# Altium schematic sheet interface.SchDoc: User interface
size A4; Author: Samuel López; DocumentNumber: 5; SheetNumber: 5; SheetTotal: 6
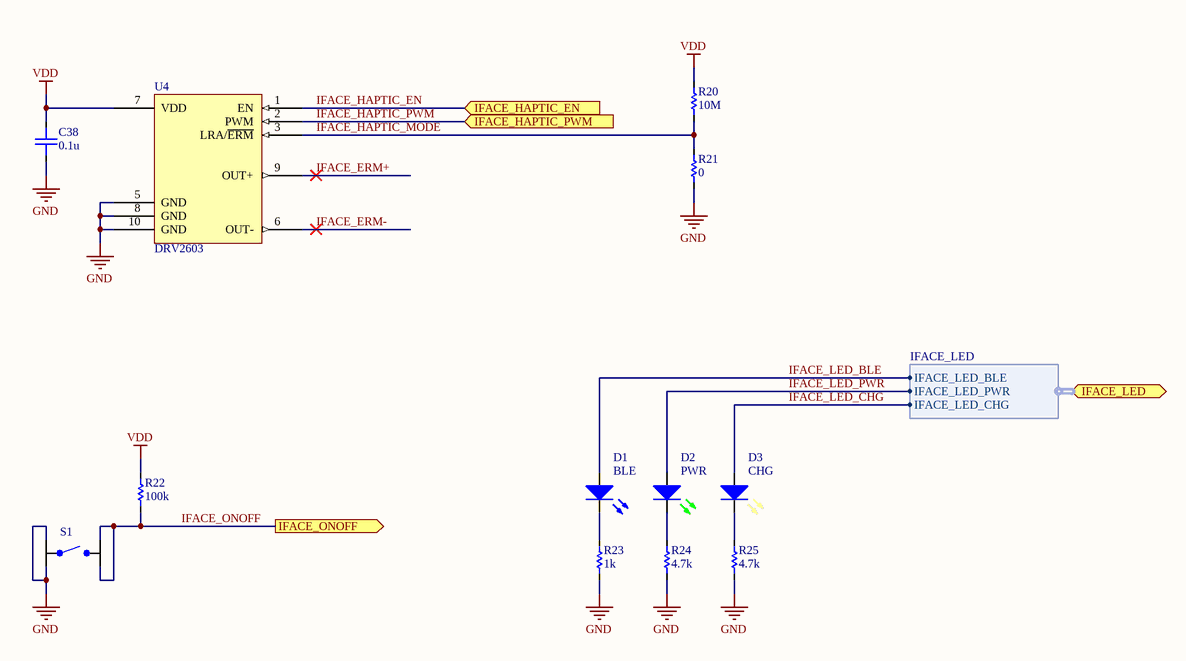
[diagram p0: interface.SchDoc]

## Parts
C38  0.1u  [C0402]
D1  BLE  [WL-SMCW 0603]
D2  PWR  [WL-SMCW 0603]
D3  CHG  [WL-SMCW 0603]
R20  10M  [R0402]
R21  0  [R0402]
R22  100k  [R0402]
R23  1k  [R0402]
R24  4.7k  [R0402]
R25  4.7k  [R0402]
S1  WE434351045816  [WE434351045816]  (value not drawn)
U4  DRV2603  [DRV2603]

## Ports
IFACE_HAPTIC_EN (in), IFACE_HAPTIC_PWM (in), IFACE_LED (harness IFACE_LED), IFACE_ONOFF (out)

## Harnesses
IFACE_LED: IFACE_LED_CHG, IFACE_LED_PWR, IFACE_LED_BLE

## Nets
GND: C38.1 R21.1 R23.1 R24.1 R25.1 S1.1 S1.3 U4.5(GND) U4.8(GND) U4.10(GND)
VDD: C38.2 R20.2 R22.2 U4.7(VDD)
IFACE_ERM+: U4.9(OUT+)
IFACE_ERM-: U4.6(OUT-)
IFACE_HAPTIC_EN: U4.1(EN) ; port IFACE_HAPTIC_EN
IFACE_HAPTIC_MODE: R20.1 R21.2 U4.3(LRA/~{ERM})
IFACE_HAPTIC_PWM: U4.2(PWM) ; port IFACE_HAPTIC_PWM
IFACE_LED_BLE: D1.2(A) ; port IFACE_LED.IFACE_LED_BLE
IFACE_LED_CHG: D3.2(A) ; port IFACE_LED.IFACE_LED_CHG
IFACE_LED_PWR: D2.2(A) ; port IFACE_LED.IFACE_LED_PWR
IFACE_ONOFF: R22.1 S1.2 S1.4 ; port IFACE_ONOFF
NetD1_1: D1.1(K) R23.2
NetD2_1: D2.1(K) R24.2
NetD3_1: D3.1(K) R25.2

## Notes on the sheet
- Title:
- Sheet
- of
- Author:
- Date:
- Time:

## Library data of the parts
C38 = Capacitor: Value: 0.1u; Rated Voltage: *
D1 = 150060BS75000: LED - Blue, 3.2V, 0603; Supplier 1: Digi-Key; Supplier Part Number 1: 732-4966-1-ND
D2 = 150060VS75000: LED - Green, 2V, 0603; Supplier 1: Digi-Key; Supplier Part Number 1: 732-4980-1-ND
D3 = 150060YS75000: LED - Yellow, 2V, 0603; Supplier 1: Digi-Key; Supplier Part Number 1: 732-4981-1-ND
R20-R25 = Resistor: Power: *
  R20: Value: 10M
  R21: Value: 0
  R22: Value: 100k
  R23: Value: 1k
  R24 R25: Value: 4.7k
S1 = WE434351045816: Switch - Tactile, Off-Mom, SPST, Side-Actuated; Supplier 1: Digi-Key; Supplier Part Number 1: 732-7057-1-ND
U4 = DRV2603: IC - Haptic Drive, ERM/LRA, Auto Resonance; Supplier 1: Digi-Key; Supplier Part Number 1: 296-30613-1-ND